# EAGLE design hivepod_interface_board_v1.1 (EAGLE 9.6.2)
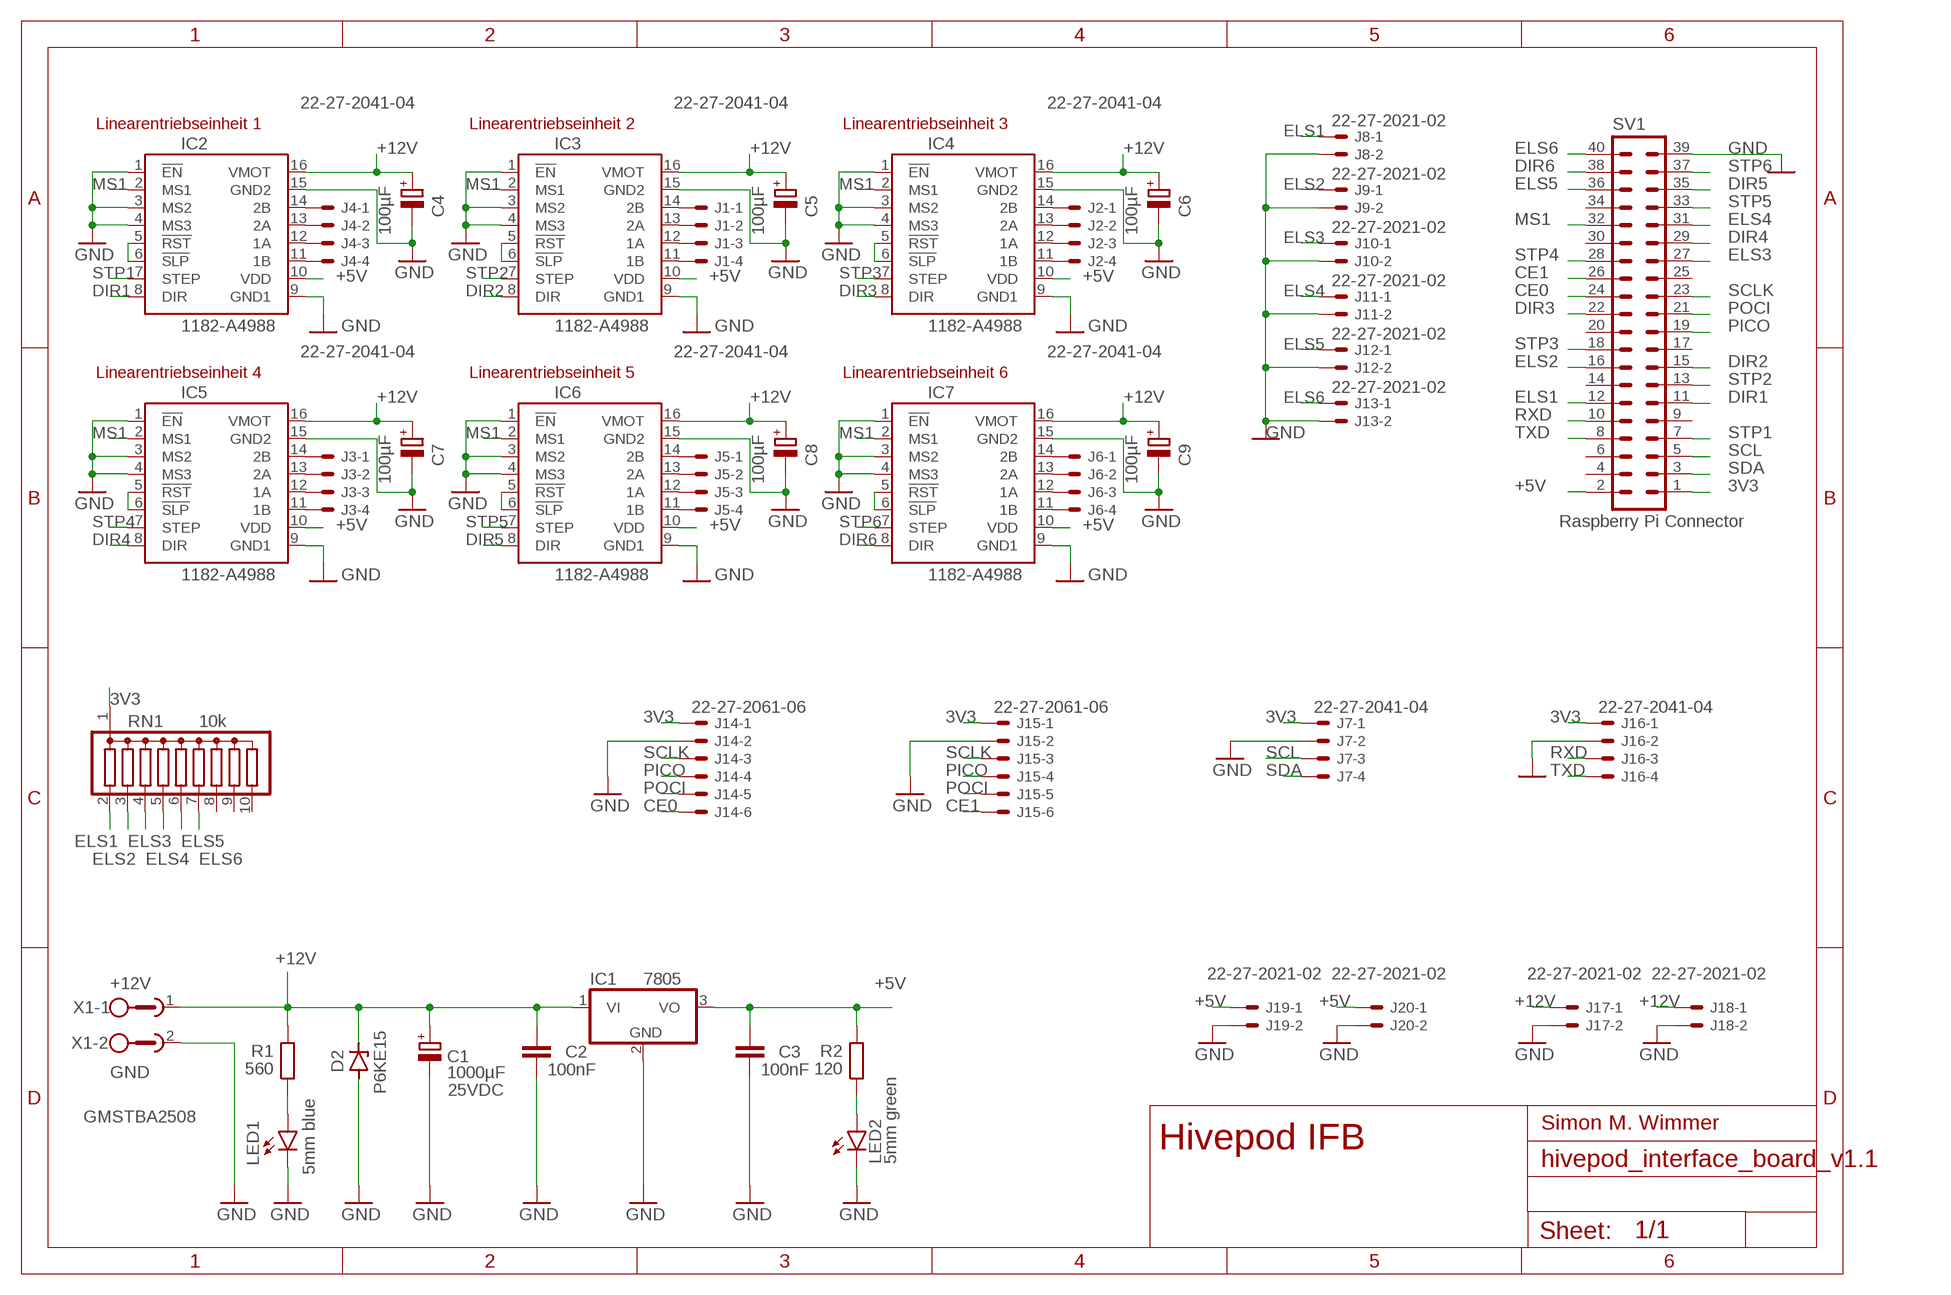
[diagram p0: schematic, sheet 1]

## Parts
C1  1000µF  CPOL-EUE5-10.5  [E5-10,5]
C2  100nF  C-EUC1206  [C1206]
C3  100nF  C-EUC1206  [C1206]
C4  100µF  CPOL-EUE5-6  [E5-6]
C5  100µF  CPOL-EUE5-6  [E5-6]
C6  100µF  CPOL-EUE5-6  [E5-6]
C7  100µF  CPOL-EUE5-6  [E5-6]
C8  100µF  CPOL-EUE5-6  [E5-6]
C9  100µF  CPOL-EUE5-6  [E5-6]
D2  P6KE15  BZY97  [F126Z12]
IC1  7805  78V  [TO220V]
IC2  1182-A4988  [A4988]
IC3  1182-A4988  [A4988]
IC4  1182-A4988  [A4988]
IC5  1182-A4988  [A4988]
IC6  1182-A4988  [A4988]
IC7  1182-A4988  [A4988]
J1  22-27-2041-04  [6410-04]
J2  22-27-2041-04  [6410-04]
J3  22-27-2041-04  [6410-04]
J4  22-27-2041-04  [6410-04]
J5  22-27-2041-04  [6410-04]
J6  22-27-2041-04  [6410-04]
J7  22-27-2041-04  [6410-04]
J8  22-27-2021-02  [6410-02]
J9  22-27-2021-02  [6410-02]
J10  22-27-2021-02  [6410-02]
J11  22-27-2021-02  [6410-02]
J12  22-27-2021-02  [6410-02]
J13  22-27-2021-02  [6410-02]
J14  22-27-2061-06  [6410-06]
J15  22-27-2061-06  [6410-06]
J16  22-27-2041-04  [6410-04]
J17  22-27-2021-02  [6410-02]
J18  22-27-2021-02  [6410-02]
J19  22-27-2021-02  [6410-02]
J20  22-27-2021-02  [6410-02]
LED1  5mm blue  LED5MM  [LED5MM]
LED2  5mm green  LED5MM  [LED5MM]
R1  560  R-EU_R1206  [R1206]
R2  120  R-EU_R1206  [R1206]
RN1  10k  G09R  [SIL10]
SV1  Raspberry Pi Connector  ML40  [ML40]
X1  GMSTBA2508  [HOR-2]

## Nets
3V3: J7.1 J14.1 J15.1 J16.1 RN1.1 SV1.1
+5V: C3.1 IC1.3(VO) IC2.10(VDD) IC3.10(VDD) IC4.10(VDD) IC5.10(VDD) IC6.10(VDD) IC7.10(VDD) J19.1 J20.1 R2.2 SV1.2
+12V: C1.+ C2.1 C4.+ C5.+ C6.+ C7.+ C8.+ C9.+ D2.C IC1.1(VI) IC2.16(VMOT) IC3.16(VMOT) IC4.16(VMOT) IC5.16(VMOT) IC6.16(VMOT) IC7.16(VMOT) J17.1 J18.1 R1.2 X1.1
CE0: J14.6 SV1.24
CE1: J15.6 SV1.26
DIR1: IC2.8(DIR) SV1.11
DIR2: IC3.8(DIR) SV1.15
DIR3: IC4.8(DIR) SV1.22
DIR4: IC5.8(DIR) SV1.29
DIR5: IC6.8(DIR) SV1.35
DIR6: IC7.8(DIR) SV1.38
ELS1: J8.1 RN1.2 SV1.12
ELS2: J9.1 RN1.3 SV1.16
ELS3: J10.1 RN1.4 SV1.27
ELS4: J11.1 RN1.5 SV1.31
ELS5: J12.1 RN1.6 SV1.36
ELS6: J13.1 RN1.7 SV1.40
GND: C1.- C2.2 C3.2 C4.- C5.- C6.- C7.- C8.- C9.- D2.A IC1.2(GND) IC2.1(!EN) IC2.3(MS2) IC2.4(MS3) IC2.9(GND1) IC2.15(GND2) IC3.1(!EN) IC3.3(MS2) IC3.4(MS3) IC3.9(GND1) IC3.15(GND2) IC4.1(!EN) IC4.3(MS2) IC4.4(MS3) IC4.9(GND1) IC4.15(GND2) IC5.1(!EN) IC5.3(MS2) IC5.4(MS3) IC5.9(GND1) IC5.15(GND2) IC6.1(!EN) IC6.3(MS2) IC6.4(MS3) IC6.9(GND1) IC6.15(GND2) IC7.1(!EN) IC7.3(MS2) IC7.4(MS3) IC7.9(GND1) IC7.15(GND2) J7.2 J8.2 J9.2 J10.2 J11.2 J12.2 J13.2 J14.2 J15.2 J16.2 J17.2 J18.2 J19.2 J20.2 LED1.K(C) LED2.K(C) SV1.39 X1.2
MS1: IC2.2(MS1) IC3.2(MS1) IC4.2(MS1) IC5.2(MS1) IC6.2(MS1) IC7.2(MS1) SV1.32
N$1: LED1.A R1.1
N$2: LED2.A R2.1
N$4: IC6.14(2B) J5.1
N$5: IC6.13(2A) J5.2
N$6: IC6.12(1A) J5.3
N$7: IC6.11(1B) J5.4
N$8: IC7.14(2B) J6.1
N$9: IC7.13(2A) J6.2
N$10: IC7.12(1A) J6.3
N$11: IC7.11(1B) J6.4
N$12: IC3.5(!RST) IC3.6(!SLP)
N$13: IC4.14(2B) J2.1
N$14: IC4.13(2A) J2.2
N$15: IC4.12(1A) J2.3
N$16: IC4.11(1B) J2.4
N$17: IC4.5(!RST) IC4.6(!SLP)
N$18: IC5.14(2B) J3.1
N$19: IC5.13(2A) J3.2
N$20: IC5.12(1A) J3.3
N$21: IC5.11(1B) J3.4
N$22: IC5.5(!RST) IC5.6(!SLP)
N$23: IC3.14(2B) J1.1
N$24: IC3.13(2A) J1.2
N$25: IC3.12(1A) J1.3
N$26: IC3.11(1B) J1.4
N$27: IC6.5(!RST) IC6.6(!SLP)
N$28: IC2.14(2B) J4.1
N$29: IC2.13(2A) J4.2
N$30: IC2.12(1A) J4.3
N$31: IC2.5(!RST) IC2.6(!SLP)
N$32: IC2.11(1B) J4.4
N$33: IC7.5(!RST) IC7.6(!SLP)
PICO: J14.4 J15.4 SV1.19
POCI: J14.5 J15.5 SV1.21
RXD: J16.3 SV1.10
SCL: J7.3 SV1.5
SCLK: J14.3 J15.3 SV1.23
SDA: J7.4 SV1.3
STP1: IC2.7(STEP) SV1.7
STP2: IC3.7(STEP) SV1.13
STP3: IC4.7(STEP) SV1.18
STP4: IC5.7(STEP) SV1.28
STP5: IC6.7(STEP) SV1.33
STP6: IC7.7(STEP) SV1.37
TXD: J16.4 SV1.8
Unconnected: RN1.8 RN1.9 RN1.10 SV1.4 SV1.6 SV1.9 SV1.14 SV1.17 SV1.20 SV1.25 SV1.30 SV1.34

## Notes on the sheet
- Linearentriebseinheit 1 | Linearentriebseinheit 2 | Linearentriebseinheit 3
- Linearentriebseinheit 4 | Linearentriebseinheit 5 | Linearentriebseinheit 6
- +12V
- GND
- 25VDC
- Simon M. Wimmer
- Hivepod IFB

## Library data of the parts
C1 = rcl:CPOL-EU: POLARIZED CAPACITOR, European symbol; SPICEPREFIX: C
C2 C3 = rcl:C-EU: CAPACITOR, European symbol; SPICEPREFIX: C
C4-C9 = rcl:CPOL-EU: POLARIZED CAPACITOR, European symbol
D2 = diode:BZY97: Z DIODE
IC1 = linear:78*: Positive VOLTAGE REGULATOR Source: http://cache.national.com/ds/LM/LM78L05.pdf http://www.fairchildsemi.com/ds/LM/LM7805.pdf
IC2-IC7 = pololu-stepper-driver:1182-A4988: A4988 Stepper Motor Driver Carrier #1182 A4988 Stepper Motor Driver Carrier <https://www.pololu.com/product/1182> in Japan, Suzaku Lab. Ltd. <https://suzakugiken.jp/> #1182 A4988ステッピングモータドライバ <https://szc.jp/po1182>
J1-J7 J16 = con-molex:22-?-04: CONNECTOR wire to board 2.54 mm (.1 inch) pitch header; MF: MOLEX; OC_FARNELL: unknown; OC_NEWARK: unknown
J8-J13 J17-J20 = con-molex:22-?-02: CONNECTOR wire to board 2.54 mm (.1 inch) pitch header; MF: MOLEX; OC_FARNELL: unknown; OC_NEWARK: unknown
J14 J15 = con-molex:22-?-06: CONNECTOR wire to board 2.54 mm (.1 inch) pitch header; OC_FARNELL: unknown; OC_NEWARK: unknown
LED1 LED2 = led:LED: LED OSRAM: - CHIPLED LG R971, LG N971, LY N971, LG Q971, LY Q971, LO R971, LY R971 LH N974, LH R974 LS Q976, LO Q976, LY Q976 LO Q996 - Hyper CHIPLED LW Q18S LB Q993, LB Q99A, LB R99A - SideLED LS A670, LO A670, LY A670, LG A670, LP A670 LB A673, LV A673, LT A673, LW A673 LH A674 LY A675 LS A676, LA A676, LO A676, LY A676, LW A676 LS A679, LY A679, LG A679 - Hyper Micro SIDELED® LS Y876, LA Y876, LO Y876, LY Y876 LT Y87S - SmartLED LW L88C, LW L88S LB L89C, LB L89S, LG L890 LS L89K, LO L89K, LY L89K LS L896, LA L896, LO L896, LY L896 - TOPLED LS T670, LO T670, LY T670, LG T670, LP T670 LSG T670, LSP T670, LSY T670, LOP T670, LYG T670 LG T671, LOG T671, LSG T671 LB T673, LV T673, LT T673, LW T673 LH T674 LS T676, LA T676, LO T676, LY T676, LB T676, LH T676, LSB T676, LW T676 LB T67C, LV T67C, LT T67C, LS T67K, LO T67K, LY T67K, LW E67C LS E67B, LA E67B, LO E67B, LY E67B, LB E67C, LV E67C, LT E67C LW T67C LS T679, LY T679, LG T679 LS T770, LO T770, LY T770, LG T770, LP T770 LB T773, LV T773, LT T773, LW T773 LH T774 LS E675, LA E675, LY E675, LS T675 LS T776, LA T776, LO T776, LY T776, LB T776 LHGB T686 LT T68C, LB T68C - Hyper Mini TOPLED® LB M676 - Mini TOPLED Santana® LG M470 LS M47K, LO M47K, LY M47K Source: http://www.osram.convergy.de LUXEON: - LUMILED® LXK2-PW12-R00, LXK2-PW12-S00, LXK2-PW14-U00, LXK2-PW14-V00 LXK2-PM12-R00, LXK2-PM12-S00, LXK2-PM14-U00 LXK2-PE12-Q00, LXK2-PE12-R00, LXK2-PE12-S00, LXK2-PE14-T00, LXK2-PE14-U00 LXK2-PB12-K00, LXK2-PB12-L00, LXK2-PB12-M00, LXK2-PB14-N00, LXK2-PB14-P00, LXK2-PB14-Q00 LXK2-PR12-L00, LXK2-PR12-M00, LXK2-PR14-Q00, LXK2-PR14-R00 LXK2-PD12-Q00, LXK2-PD12-R00, LXK2-PD12-S00 LXK2-PH12-R00, LXK2-PH12-S00 LXK2-PL12-P00, LXK2-PL12-Q00, LXK2-PL12-R00 Source: www.luxeon.com KINGBRIGHT: KA-3528ASYC Source: www.kingbright.com
R1 R2 = rcl:R-EU_: RESISTOR, European symbol
RN1 = resistor-sil:G09R: SIL RESISTOR; OC_FARNELL: unknown; OC_NEWARK: unknown
SV1 = con-ml:ML40: HARTING; OC_FARNELL: unknown; OC_NEWARK: unknown
X1 = con-phoenix-508:GMSTBA2: PHOENIX

## Board
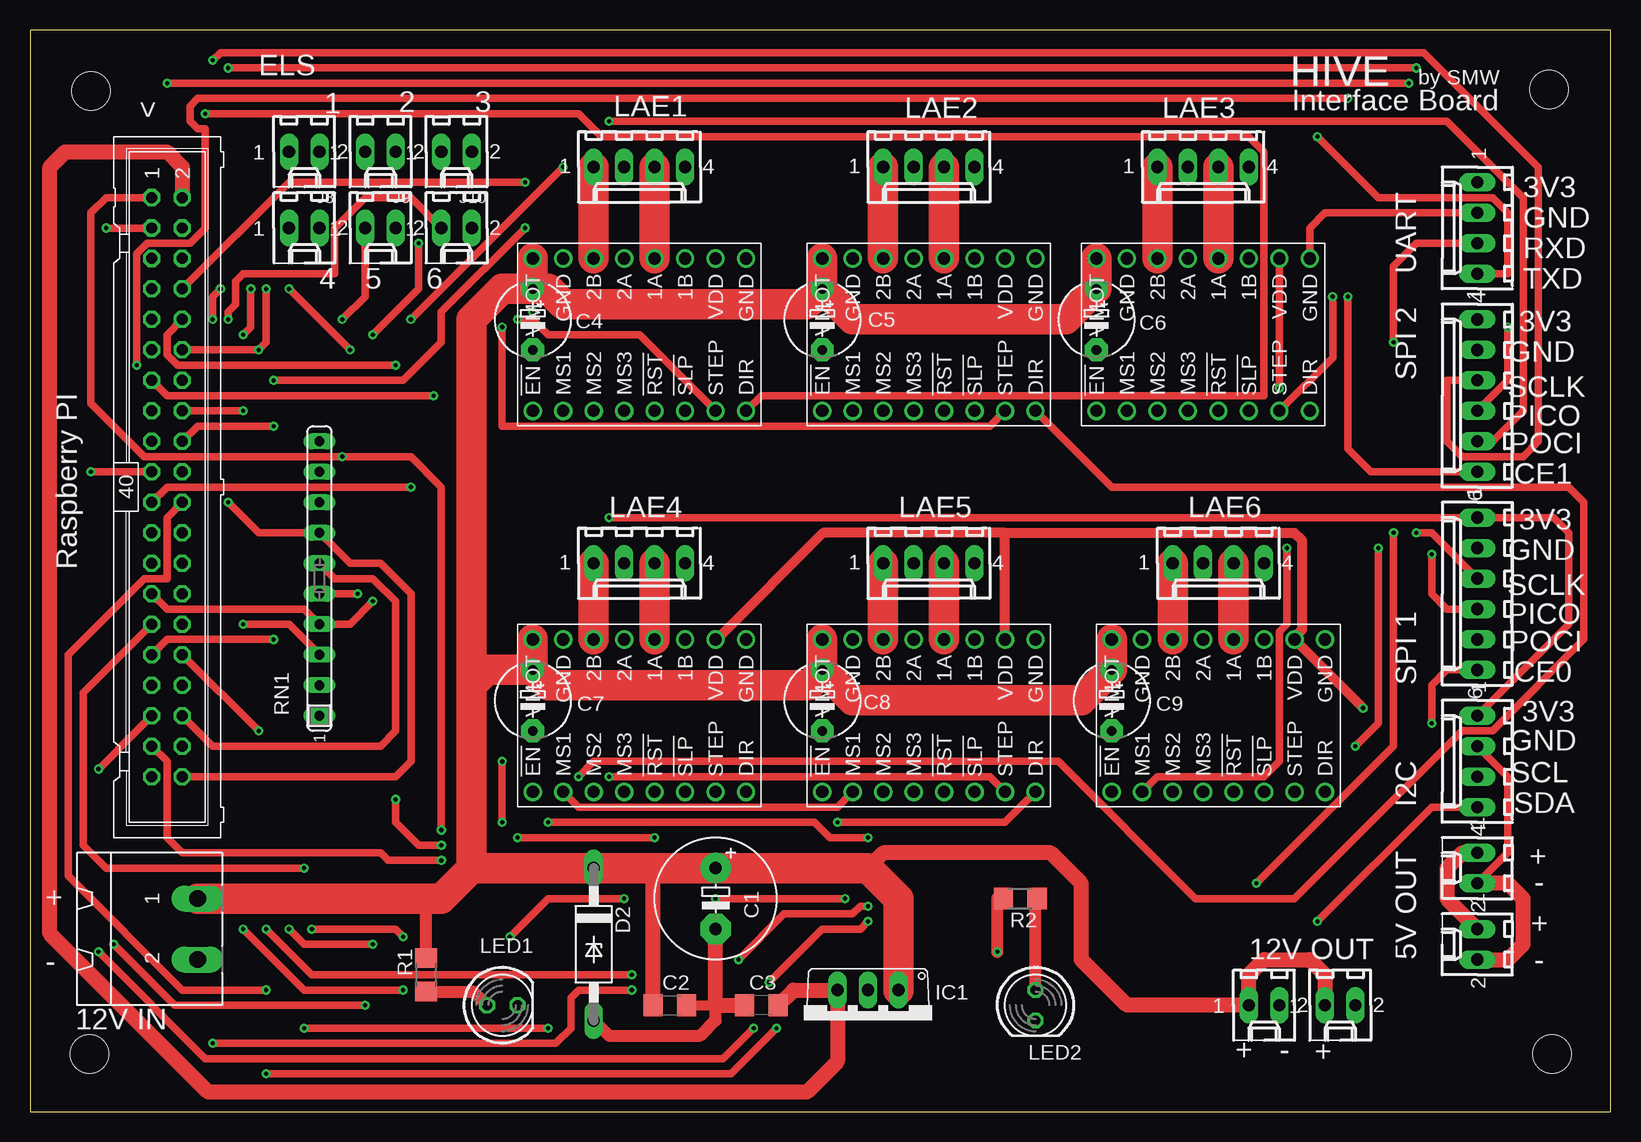
[diagram p1: board, top side]
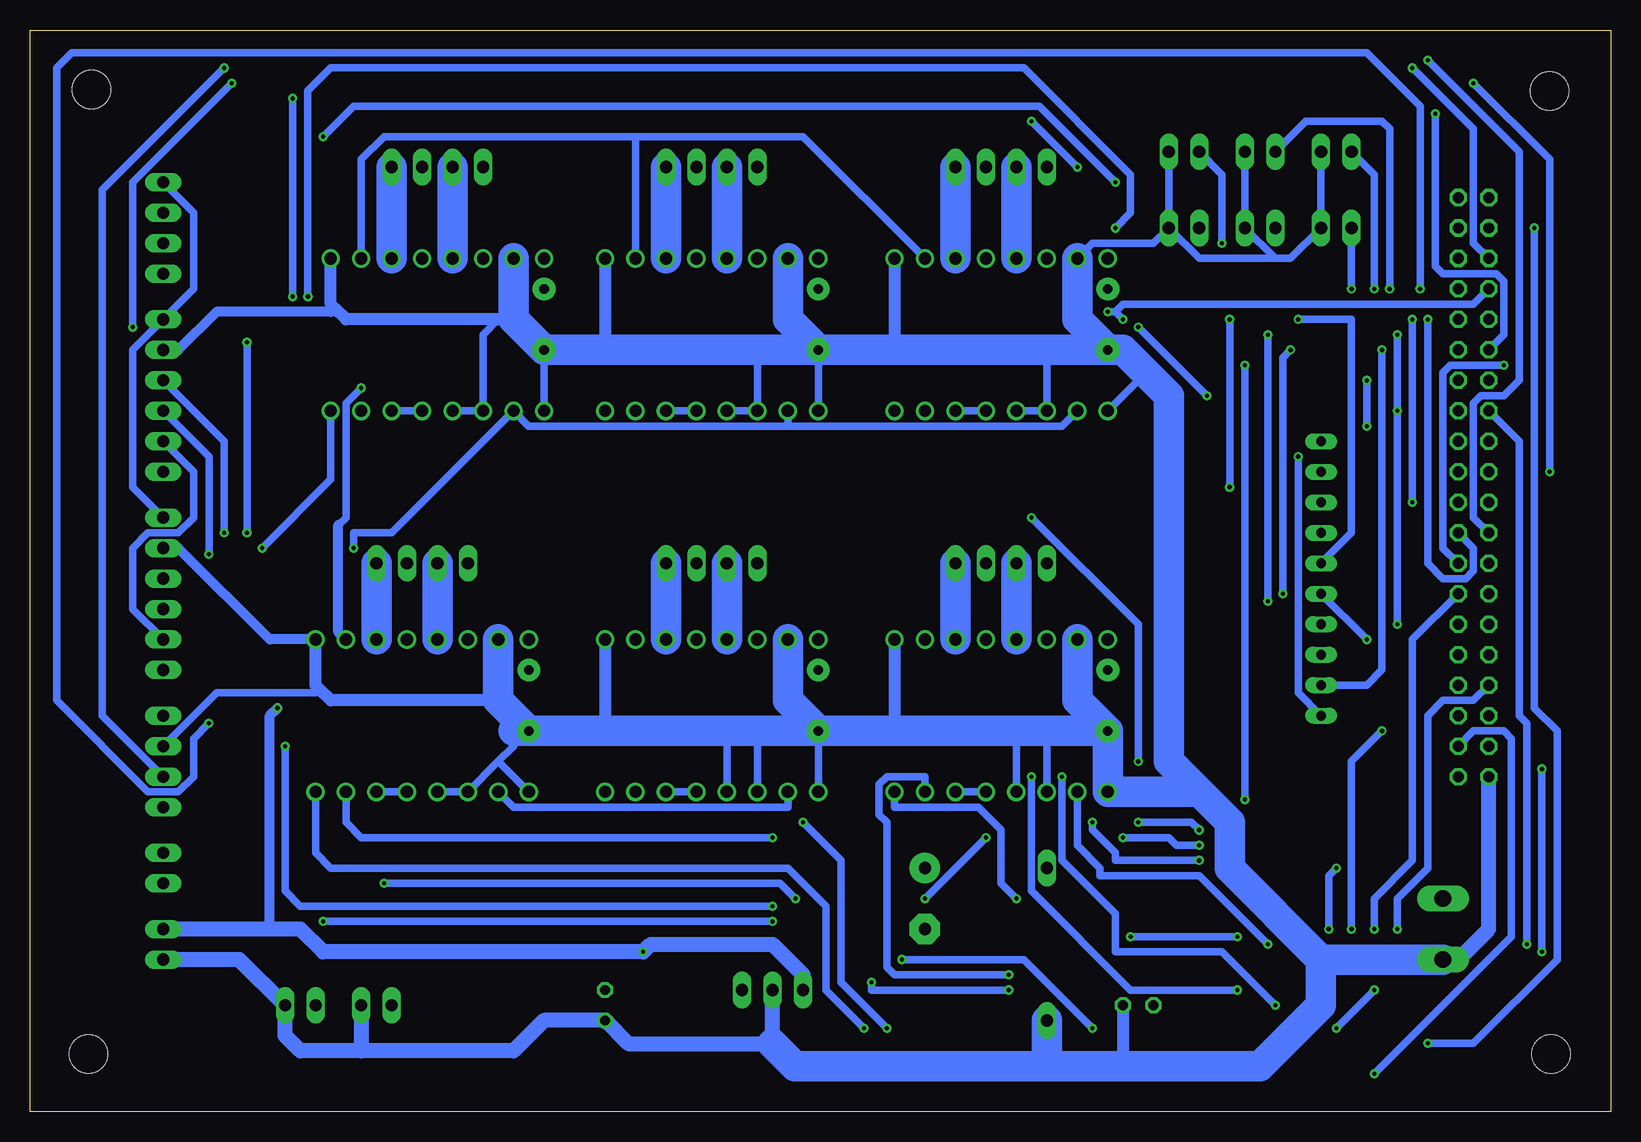
[diagram p2: board, bottom side, seen from below]

Size 131.75 x 90.16 mm. Coordinates in mm from the lower left corner, seen from the top.
Outline: 0,0 131.75,0 131.75,90.16 0,90.16 0,0
Copper layers (1*16): Top 0.035mm / dielectric 1.5mm / Bottom 0.035mm
Design rules "default *": minimum track width 24mil, minimum drill 0.35mm, track to track 20mil, track to pad 6mil, pad to pad 6mil, via to via 6mil, smd to smd 6mil, copper to edge 40mil, drill to drill 6mil, minimum pad ring 10mil, minimum via ring 8mil, stop-mask expansion 4mil, vias tented up to drill 0mil, thermal gap 10mil
Holes 3.2 mm at 4.95,4.83 126.87,4.83 126.62,85.22 5.08,85.09

### Footprints (pad centres in the part's own frame; a part is rotated, then mirrored left to right if it is on the bottom)
E5-10,5 = drill 1.016 pad 2.54: + -2.54,0 | drill 1.016 pad 2.54 octagon: - 2.54,0
C1206 = smd 1.6 x 1.8: 1 -1.4,0; 2 1.4,0
E5-6 = drill 0.813 pad 1.905: + -2.54,0 | drill 0.813 pad 1.905 octagon: - 2.54,0
F126Z12 = drill 1.016 long: A 6.35,0; C -6.35,0
TO220V = drill 1.016 long: 1 -2.54,-2.54; 2 0,-2.54; 3 2.54,-2.54
A4988 = drill 1.016: 1 -6.35,8.89; 2 -6.35,6.35; 3 -6.35,3.81; 4 -6.35,1.27; 5 -6.35,-1.27; 6 -6.35,-3.81; 7 -6.35,-6.35; 8 -6.35,-8.89; 9 6.35,-8.89; 10 6.35,-6.35; 11 6.35,-3.81; 12 6.35,-1.27; 13 6.35,1.27; 14 6.35,3.81; 15 6.35,6.35; 16 6.35,8.89
6410-04 = drill 1.016 long: 1 3.81,0; 2 1.27,0; 3 -1.27,0; 4 -3.81,0
6410-02 = drill 1.016 long: 1 1.27,0; 2 -1.27,0
6410-06 = drill 1.016 long: 1 6.35,0; 2 3.81,0; 3 1.27,0; 4 -1.27,0; 5 -3.81,0; 6 -6.35,0
LED5MM = drill 0.813 octagon: A -1.27,0; K 1.27,0
R1206 = smd 1.6 x 1.8: 1 -1.4,0; 2 1.4,0
SIL10 = drill 0.813 long: 1 -11.43,0; 2 -8.89,0; 3 -6.35,0; 4 -3.81,0; 5 -1.27,0; 6 1.27,0; 7 3.81,0; 8 6.35,0; 9 8.89,0; 10 11.43,0
ML40 = drill 0.914 octagon: 1 -24.13,-1.27; 2 -24.13,1.27; 3 -21.59,-1.27; 4 -21.59,1.27; 5 -19.05,-1.27; 6 -19.05,1.27; 7 -16.51,-1.27; 8 -16.51,1.27; 9 -13.97,-1.27; 10 -13.97,1.27; 11 -11.43,-1.27; 12 -11.43,1.27; 13 -8.89,-1.27; 14 -8.89,1.27; 15 -6.35,-1.27; 16 -6.35,1.27; 17 -3.81,-1.27; 18 -3.81,1.27; 19 -1.27,-1.27; 20 -1.27,1.27; 21 1.27,-1.27; 22 1.27,1.27; 23 3.81,-1.27; 24 3.81,1.27; 25 6.35,-1.27; 26 6.35,1.27; 27 8.89,-1.27; 28 8.89,1.27; 29 11.43,-1.27; 30 11.43,1.27; 31 13.97,-1.27; 32 13.97,1.27; 33 16.51,-1.27; 34 16.51,1.27; 35 19.05,-1.27; 36 19.05,1.27; 37 21.59,-1.27; 38 21.59,1.27; 39 24.13,-1.27; 40 24.13,1.27
HOR-2 = drill 1.397 pad 2.184 long: 1 -2.54,10.16; 2 2.54,10.16

### Placement (x,y rotation side)
C1  57.15,17.78 270 top
C2  53.34,8.89 0 top
C3  60.96,8.89 180 top
C4  41.91,66.04 270 top
C5  66.04,66.04 270 top
C6  88.9,66.04 270 top
C7  41.91,34.29 270 top
C8  66.04,34.29 270 top
C9  90.17,34.29 270 top
D2  46.99,13.97 270 top
IC1  69.85,7.62 180 top
IC2  50.8,64.77 90 top
IC3  74.93,64.77 90 top
IC4  97.79,64.77 90 top
IC5  50.8,33.02 90 top
IC6  74.93,33.02 90 top
IC7  99.06,33.02 90 top
J1  74.93,78.74 180 top
J2  97.79,78.74 180 top
J3  50.8,45.72 180 top
J4  50.8,78.74 180 top
J5  74.93,45.72 180 top
J6  99.06,45.72 180 top
J7  120.65,29.21 90 top
J8  22.86,80.01 180 top
J9  29.21,80.01 180 top
J10  35.56,80.01 180 top
J11  22.86,73.66 180 top
J12  29.21,73.66 180 top
J13  35.56,73.66 180 top
J14  120.65,43.18 90 top
J15  120.65,59.69 90 top
J16  120.65,73.66 90 top
J17  102.87,8.89 180 top
J18  109.22,8.89 180 top
J19  120.65,13.97 90 top
J20  120.65,20.32 90 top
LED1  39.37,8.89 0 top
LED2  83.82,8.89 270 top
R1  33.02,11.43 90 top
R2  82.55,17.78 180 top
RN1  24.13,44.45 90 top
SV1  11.43,52.07 270 top
X1  3.81,15.24 270 top

### Tracks (layer width: path | path; a pad name or v marks a point on that pad's centre or on a via)
3V3  (via drill 0.35)
  Top 0.61: J7.1 128.27,40.64 128.27,48.26 127,49.53 J14.1 v48.26,49.53 | SV1.1 6.35,76.2 5.08,74.93 5.08,59.05 9.53,54.61 v26.04,54.61 31.75,54.61 34.29,52.07 v34.29,23.5 | v39.37,24.13 v39.37,29.21
  Bottom 0.61: J16.1 118.11,74.93 118.11,68.58 J15.1 123.19,63.5 123.19,52.07 J14.1 | RN1.1 26.04,34.92 v26.04,54.61 | v48.26,49.53 39.37,40.64 v39.37,29.21 | v39.37,24.13 34.92,24.13 v34.29,23.5
+5V  (via drill 0.35)
  Top 0.61: 80.64,17.78 R2.2 | v104.14,60.33 IC4.10 | 81.28,48.21 81.28,48.26
  Top 0.813: IC5.10 57.43,39.57 66.12,48.26 81.28,48.26 105.41,48.26 106.05,47.62 106.05,40.19 105.41,39.55 IC7.10 v111.12,33.66 | IC6.10 81.28,48.21
  Top 1.016: v80.64,13.34 80.64,17.78
  Top 1.27: C3.1 63.63,10.16 IC1.3 67.31,4.19 64.77,1.65 14.86,1.65 1.65,14.86 1.65,78.74 2.92,80.01 11.43,80.01 12.7,78.74 SV1.2 | J19.1 118.11,17.78 118.11,20.32 119.38,21.59 J20.1
  Bottom 0.61: IC2.10 67.31,81.28 81.28,81.28 | IC3.10 81.28,81.28 | IC4.10 104.14,79.38 102.23,81.28 81.28,81.28 | v104.14,60.33 105.41,59.05 105.41,49.53 106.05,48.9
  Bottom 0.813: v111.12,33.66 111.76,33.02 111.76,15.24 | 106.05,48.9 106.05,40.01 IC7.10
  Bottom 1.27: IC1.3 67.31,11.43 69.85,13.97 80.01,13.97 v80.64,13.34 107.31,13.34 109.22,15.24 111.76,15.24 J19.1
+12V
  Top 0.61: C8.+ 66.04,36.68
  Top 1.016: R1.2 33.02,17.78
  Top 1.27: J18.1 107.95,11.43 106.68,12.7 102.87,12.7 101.6,11.43 J17.1 91.44,8.89 87.63,12.7 87.63,19.05 85.09,21.59 71.12,21.59 69.85,20.32 | C2.1 51.94,20.19 52.07,20.32
  Top 2.54: C7.+ IC5.16 | IC6.16 C8.+ 68.58,34.29 87.63,34.29 C9.+ IC7.16 | IC4.16 C6.+ 86.36,66.04 68.58,66.04 C5.+ | C5.+ IC3.16 | C4.+ IC2.16 | 36.83,35.56 36.83,20.32 | 36.83,35.56 38.1,36.83 C7.+ | 36.83,35.56 36.83,66.04 39.37,68.58 C4.+ | IC1.1 72.39,17.78 69.85,20.32 C1.+ 52.07,20.32 D2.C 36.83,20.32 | 36.83,20.32 34.29,17.78 33.02,17.78 X1.1 | C7.+ 43.18,35.56 64.92,35.56 66.04,36.68 | C4.+ 43.18,68.58 44.45,67.31 64.77,67.31 C5.+
CE0  (via drill 0.35)
  Top 0.61: v15.24,66.04 15.24,67.94 v15.88,68.58 | v116.84,32.38 116.84,35.56 118.11,36.83 J14.6
  Bottom 0.61: SV1.24 11.43,46.99 11.43,45.09 12.06,44.45 13.97,44.45 15.24,45.72 v15.24,66.04 | v15.88,68.58 15.88,83.82 20.32,88.27 128.27,88.27 129.54,87 129.54,34.29 121.92,26.67 119.38,26.67 118.11,27.94 118.11,31.11 v116.84,32.38
CE1  (via drill 0.35)
  Top 0.61: v109.86,84.45 13.97,84.45 13.34,83.82 13.34,82.55 13.97,81.92 14.61,81.92 14.61,73.66 13.34,72.39 9.78,72.39 8.89,71.5 v8.89,62.23 | J15.6 111.76,53.34 109.86,55.24 v109.86,67.94
  Bottom 0.61: SV1.26 13.97,46.99 13.97,61.59 13.34,62.23 v8.89,62.23 | v109.86,67.94 v109.86,84.45
DIR1  (via drill 0.35)
  Top 0.61: v14.61,83.19 45.72,83.19 47.62,81.28 101.6,81.28 102.87,80.01 102.87,59.69 60.96,59.69 IC2.8
  Bottom 0.61: SV1.11 8.89,64.77 8.89,69.22 9.53,69.85 13.97,69.85 14.61,70.48 v14.61,83.19
DIR2  (via drill 0.35)
  Top 0.61: v6.99,13.97 12.06,8.89 v27.94,8.89 | v45.72,27.94 46.99,29.21 85.72,29.21 97.16,17.78 105.41,17.78 119.38,31.75 121.92,31.75 129.54,39.37 129.54,50.8 128.27,52.07 90.17,52.07 IC3.8
  Bottom 0.61: SV1.15 7.62,55.88 7.62,33.02 6.99,32.38 v6.99,13.97 | v27.94,8.89 32.38,13.34 41.27,13.34 41.27,16.51 45.72,20.95 v45.72,27.94
DIR3  (via drill 0.35)
  Top 0.61: SV1.22 11.43,49.53 11.43,44.45 9.53,44.45 3.17,38.1 3.17,19.68 12.7,10.16 v19.68,10.16 | v43.18,6.99 v22.86,6.99 | v59.05,12.7 62.87,16.51 68.58,16.51 69.22,17.14 v69.85,17.14 | v110.49,30.48 112.39,32.38 v112.39,46.99
  Bottom 0.61: v22.86,6.99 v19.68,10.16 | v43.18,6.99 48.9,12.7 v59.05,12.7 | v69.85,17.14 109.22,17.14 110.49,18.41 v110.49,30.48 | v112.39,46.99 106.68,52.7 IC4.8
DIR4  (via drill 0.35)
  Top 0.61: SV1.29 4.45,34.92 4.45,22.23 6.35,20.32 v22.86,20.32 | v23.5,15.24 30.48,15.24 v31.11,14.61 | v40.01,14.61 43.18,17.78 v49.53,17.78
  Bottom 0.61: v22.86,20.32 23.5,19.68 v23.5,15.24 | v40.01,14.61 v31.11,14.61 | v49.53,17.78 50.8,19.05 50.8,23.5 52.7,25.4 59.69,25.4 IC5.8
DIR5  (via drill 0.35)
  Top 0.61: v5.71,28.57 8.89,31.75 SV1.35 | v5.71,13.34 14.61,4.45 57.78,4.45 v60.33,6.99 | v67.31,24.13 81.28,24.13 IC6.8
  Bottom 0.61: v5.71,13.34 v5.71,28.57 | v60.33,6.99 64.14,10.79 64.14,20.95 v67.31,24.13
DIR6  (via drill 0.35)
  Top 0.61: v19.68,3.17 58.42,3.17 v62.23,6.99
  Bottom 0.61: SV1.38 11.43,31.75 8.89,31.75 8.26,31.11 8.26,14.61 v19.68,3.17 | v62.23,6.99 65.41,10.16 65.41,17.14 68.58,20.32 106.68,20.32 107.95,21.59 IC7.8
ELS1  (via drill 0.35)
  Top 0.61: SV1.12 v19.05,63.5 19.68,64.14 v19.68,68.58
  Bottom 0.61: RN1.2 20.32,35.56 19.05,36.83 v19.05,63.5 | J8.1 19.68,78.11 v19.68,68.58
ELS2  (via drill 0.35)
  Top 0.61: RN1.3 21.59,40.64 v17.78,40.64 | SV1.16 v17.78,58.42 | v17.78,64.77 18.41,65.41 v18.41,68.58
  Bottom 0.61: v17.78,40.64 v17.78,58.42 v17.78,64.77 | J9.1 25.4,82.55 19.05,82.55 18.41,81.92 v18.41,68.58
ELS3  (via drill 0.35)
  Top 0.61: SV1.27 11.43,41.91 22.86,41.91 RN1.4 26.67,40.64 v28.57,42.55 | v32.38,72.39 32.38,68.58 v28.57,64.77
  Bottom 0.61: J10.1 32.38,78.11 v32.38,72.39 | v28.57,42.55 v28.57,64.77
ELS4  (via drill 0.35)
  Top 0.61: v20.32,39.37 11.43,39.37 SV1.31 | v26.67,63.5 v21.59,68.58 | RN1.5 v27.3,43.18
  Bottom 0.61: v20.32,39.37 RN1.5 | v21.59,68.58 J11.1 | v26.67,63.5 27.3,62.87 v27.3,43.18
ELS5  (via drill 0.35)
  Top 0.61: RN1.6 25.4,44.45 28.57,44.45 30.48,42.55 30.48,31.75 29.21,30.48 15.24,30.48 SV1.36 | v26.04,66.04 27.94,67.94 J12.1
  Bottom 0.61: v26.04,66.04 21.59,66.04 21.59,48.26 RN1.6
ELS6  (via drill 0.35)
  Top 0.61: SV1.40 30.48,27.94 31.75,29.21 31.75,43.18 29.21,45.72 26.67,45.72 RN1.7 19.05,48.26 v16.51,50.8 | J13.1 31.75,76.2 27.94,76.2 25.4,73.66 25.4,69.85 17.78,69.85 17.14,69.22 17.14,67.31 16.51,66.67 v16.51,66.04
  Bottom 0.61: v16.51,50.8 v16.51,66.04
GND
  Top 0.61: J16.2 107.95,74.93 106.68,73.66 IC4.9 | J20.2 123.19,21.59 123.19,27.94 J7.2
  Top 0.813: C2.2 57.15,8.89
  Top 1.016: D2.A 48.26,6.35 55.88,6.35 57.15,7.62 57.15,8.89
  Top 1.27: C3.2 57.15,8.89 C1.- | J19.2 123.19,12.7 124.46,13.97 124.46,17.78 123.19,19.05 J20.2
  Bottom 0.61: IC5.3 46.99,31.75 | IC5.4 49.53,31.75 | IC6.3 71.12,31.75 | IC6.4 73.66,31.75 | 92.71,29.21 IC7.3 IC7.4 | 92.71,29.21 91.44,30.48 91.44,31.75 | 46.99,63.5 IC2.3 IC2.4 | 71.12,63.5 IC3.3 IC3.4 | 91.44,66.04 92.71,66.04 93.98,64.77 IC4.3 IC4.4 | 27.94,71.12 J12.2 J9.2 | J13.2 34.29,71.12 27.94,71.12 | J7.2 116.2,34.92 107.95,34.92 107.63,35.24 | C8.- IC6.1 | 38.73,61.59 IC2.1 | C5.- IC3.1 | C6.- IC4.1 | 92.71,29.21 IC7.1 | 106.68,66.67 106.36,66.99 | J13.2 38.1,72.39 43.18,72.39 IC2.15 | 27.94,71.12 26.67,71.12 J11.2 J8.2 | J13.2 J10.2
  Bottom 0.813: J14.2 119.38,46.99 111.76,39.37 IC7.9 | J15.2 119.38,63.5 116.2,66.67 106.68,66.67
  Bottom 1.016: IC3.9 83.82,63.5 | 92.71,66.04 105.41,66.04 106.36,66.99 106.68,67.31 IC4.9 | IC2.9 59.69,63.5 | IC5.9 59.69,31.75 | IC6.9 83.82,31.75 | 92.71,34.29 106.68,34.29 107.63,35.24 107.95,35.56 IC7.9 | LED1.K 40.64,3.81
  Bottom 1.27: IC1.2 69.88,10.13 69.88,5.7 69.87,5.69 81.89,5.69 LED2.K 88.9,7.62 91.44,5.08 104.14,5.08 | 104.14,5.08 109.22,5.08 110.49,6.35 J18.2 114.3,12.7 J19.2 | J17.2 104.14,5.08 | X1.2 12.7,12.7 10.16,15.24 SV1.39
  Bottom 2.54: IC2.15 44.45,66.04 C4.- | IC3.15 68.58,66.04 C5.- | IC4.15 91.44,66.04 C6.- 83.82,63.5 71.12,63.5 C5.- | IC7.15 92.71,34.29 C9.- | IC6.15 68.58,34.29 C8.- | IC5.15 44.45,34.29 C7.- | X1.2 24.13,12.7 | 24.13,12.7 31.75,20.32 31.75,24.13 34.29,26.67 | 34.29,26.67 IC5.1 C7.- | C7.- 46.99,31.75 49.53,31.75 59.69,31.75 C8.- | 91.44,31.75 C9.- | C9.- 83.82,31.75 73.66,31.75 71.12,31.75 C8.- | 34.29,26.67 36.83,29.21 36.83,59.69 38.73,61.59 40.64,63.5 C4.- | C4.- 46.99,63.5 59.69,63.5 C5.- | 69.87,5.69 67.99,3.81 46.99,3.81 | 24.13,12.7 24.13,8.89 29.21,3.81 40.64,3.81 46.99,3.81 | D2.A 46.99,3.81
MS1  (via drill 0.35)
  Top 0.61: v19.05,31.75 SV1.32 | v21.59,15.24 22.86,13.97 v28.57,13.97 | IC6.2 67.31,25.4 45.72,25.4 IC5.2 | v104.78,46.99 104.78,40.64 104.14,40.01 104.14,29.21 102.87,27.94 93.98,27.94 IC7.2
  Bottom 0.61: IC2.2 45.72,57.15 68.58,57.15 | IC3.2 68.58,57.15 | 68.58,57.15 90.17,57.15 IC4.2 101.6,48.26 104.78,48.26 v104.78,46.99 | v19.05,31.75 21.59,29.21 v21.59,15.24 | v28.57,13.97 34.29,19.68 42.55,19.68 42.55,20.32 44.45,22.23 IC5.2 | IC7.2 91.44,25.4 68.58,25.4 IC6.2
N$1
  Top 1.016: R1.1 36.96,10.03 LED1.A
N$2
  Top 0.61: 83.82,17.78 R2.1
  Top 1.016: LED2.A 83.82,17.78
N$4
  Top 2.54: IC6.14 J5.1
N$5
  Bottom 2.54: IC6.13 J5.2
N$6
  Top 2.54: IC6.12 J5.3
N$7
  Bottom 2.54: IC6.11 J5.4
N$8
  Top 2.54: IC7.14 J6.1
N$9
  Bottom 2.54: IC7.13 J6.2
N$10
  Top 2.54: IC7.12 J6.3
N$11
  Bottom 2.54: IC7.11 J6.4
N$12
  Bottom 0.61: IC3.5 IC3.6
N$13
  Top 2.54: IC4.14 J2.1
N$14
  Bottom 2.54: J2.2 IC4.13
N$15
  Top 2.54: IC4.12 J2.3
N$16
  Bottom 2.54: IC4.11 J2.4
N$17
  Bottom 0.61: IC4.5 IC4.6
N$18
  Top 2.54: IC5.14 J3.1
N$19
  Bottom 2.54: IC5.13 J3.2
N$20
  Top 2.54: IC5.12 J3.3
N$21
  Bottom 2.54: IC5.11 J3.4
N$22
  Bottom 0.61: IC5.5 IC5.6
N$23
  Top 2.54: IC3.14 J1.1
N$24
  Bottom 2.54: IC3.13 J1.2
N$25
  Top 2.54: IC3.12 J1.3
N$26
  Bottom 2.54: IC3.11 J1.4
N$27
  Bottom 0.61: IC6.5 IC6.6
N$28
  Top 2.54: IC2.14 J4.1
N$29
  Bottom 2.54: IC2.13 J4.2
N$30
  Top 2.54: IC2.12 J4.3
N$31
  Bottom 0.61: IC2.5 IC2.6
N$32
  Bottom 2.54: IC2.11 J4.4
N$33
  Bottom 0.61: IC7.5 IC7.6
PICO  (via drill 0.35)
  Top 0.61: v5.08,53.34 SV1.19 | v114.94,85.72 v11.43,85.72 | v123.19,65.41 123.19,60.96 J15.4 | J14.4 118.11,41.91 116.84,43.18 v116.84,46.48
  Bottom 0.61: v5.08,53.34 5.08,79.38 v11.43,85.72 | v114.94,85.72 123.19,77.47 v123.19,65.41 | J15.4 116.81,54.58 116.81,46.51 v116.84,46.48
POCI  (via drill 0.35)
  Top 0.61: SV1.21 11.43,52.07 v31.75,52.07 | v44.45,78.74 v31.75,66.04 | v48.26,82.55 118.11,82.55 124.46,76.2 124.46,58.42 121.92,55.88 J15.5
  Bottom 0.61: v31.75,66.04 v31.75,52.07 | v48.26,82.55 v44.45,78.74 | J14.5 123.19,41.91 123.19,46.99 121.92,48.26 119.38,48.26 118.11,49.53 118.11,53.34 J15.5
RXD  (via drill 0.35)
  Top 0.61: SV1.10 11.43,64.77 11.43,63.12 12.32,62.23 v30.48,62.23 | v30.48,26.04 30.48,24.13 32.38,22.23 v34.29,22.23 | v52.07,22.86 v40.64,22.86 | v67.94,17.78 v57.15,17.78 | v102.23,19.05 113.67,30.48 v113.67,48.26 | v113.67,64.14 113.67,70.48 115.57,72.39 J16.3
  Bottom 0.61: v30.48,26.04 v30.48,62.23 | v34.29,22.23 36.2,22.23 36.83,22.86 v40.64,22.86 | v57.15,17.78 v52.07,22.86 | v67.94,17.78 69.22,19.05 v102.23,19.05 | v113.67,48.26 v113.67,64.14
SCL  (via drill 0.35)
  Top 0.61: v115.57,87 v16.51,87
  Bottom 0.61: SV1.5 11.43,72.39 11.43,81.92 14.29,84.77 v16.51,87 | v115.57,87 125.73,76.83 125.73,33.02 J7.3
SCLK  (via drill 0.35)
  Top 0.61: v15.24,87.63 15.88,88.27 116.2,88.27 125.73,78.74 125.73,55.88 124.46,54.61 119.38,54.61 118.11,55.88 118.11,60.96 J15.3 | J14.3 116.84,48.26 v115.57,48.26
  Bottom 0.61: SV1.23 11.43,49.53 11.43,59.05 10.79,59.69 8.89,59.69 7.62,60.96 7.62,80.01 v15.24,87.63 | v115.57,48.26 115.57,55.88 J15.3
SDA  (via drill 0.35)
  Top 0.61: v6.35,73.66 SV1.3 | v15.24,5.71 43.81,5.71 45.09,6.99 45.09,9.53 45.72,10.16 v50.16,10.16 | v61.59,10.79 66.04,15.24 69.22,15.24 v69.85,15.88 | v107.31,15.88 116.84,25.4 J7.4
  Bottom 0.61: v6.35,73.66 6.35,33.66 4.45,31.75 4.45,12.7 11.43,5.71 v15.24,5.71 | v50.16,10.16 61.59,10.16 v61.59,10.79 | v107.31,15.88 v69.85,15.88
STP1  (via drill 0.35)
  Top 0.61: IC2.7 50.8,64.77 43.18,64.77 41.91,66.04 v40.64,66.04
  Bottom 0.61: SV1.7 11.43,67.31 40.64,67.31 41.27,66.67 | v41.91,66.67 41.27,66.67 | 41.27,66.67 v40.64,66.04
STP2  (via drill 0.35)
  Top 0.61: SV1.13 11.43,59.69 v33.66,59.69 | v39.37,65.41 39.37,57.15 80.01,57.15 IC3.7
  Bottom 0.61: v39.37,65.41 v33.66,59.69
STP3  (via drill 0.35)
  Top 0.61: SV1.18 13.97,57.15 v20.32,57.15 | v20.32,60.96 31.11,60.96 34.29,64.14 34.29,66.67 v41.27,73.66 | IC4.7 108.58,62.87 v108.58,67.94
  Bottom 0.61: v20.32,60.96 v20.32,57.15 | v41.27,73.66 40.01,74.93 40.01,78.11 48.9,87 106.68,87 108.58,85.09 v108.58,67.94
STP4  (via drill 0.35)
  Top 0.61: v19.68,15.24 23.5,11.43 v50.16,11.43
  Bottom 0.61: SV1.28 16.51,39.37 16.51,20.95 19.68,17.78 v19.68,15.24 | v50.16,11.43 59.69,11.43 60.33,12.06 60.33,24.13 60.96,24.77 60.96,27.3 60.33,27.94 57.15,27.94 IC5.7
STP5  (via drill 0.35)
  Top 0.61: v17.78,15.24 22.86,10.16 v31.11,10.16 | v48.26,27.94 80.01,27.94 IC6.7
  Bottom 0.61: SV1.33 11.43,34.29 13.97,34.29 15.24,33.02 15.24,20.32 17.78,17.78 v17.78,15.24 | v31.11,10.16 40.01,10.16 48.26,18.41 v48.26,27.94
STP6  (via drill 0.35)
  Top 0.61: SV1.37 11.43,29.21 11.43,22.86 12.7,21.59 29.21,21.59 29.84,20.95 v34.29,20.95 | v43.18,24.13 65.41,24.13 66.67,22.86 v69.85,22.86
  Bottom 0.61: v34.29,20.95 41.27,20.95 41.27,21.59 43.18,23.5 v43.18,24.13 | v69.85,22.86 104.14,22.86 105.41,24.13 IC7.7
TXD  (via drill 0.35)
  Top 0.61: SV1.8 21.59,77.47 v41.27,77.47 | v107.31,81.28 112.39,76.2 121.92,76.2 123.19,74.93 123.19,69.85 J16.4
  Bottom 0.61: v41.27,77.47 47.62,83.82 104.78,83.82 v107.31,81.28

### Text on the board
tNames: ELS | by SMW | HIVE | < | 1 | 2 | 3 | LAE1 | LAE2 | LAE3 | Interface Board | 3V3 | GND | RXD | UART | 4 | 5 | 6 | TXD | 3V3 | GND | SPI 2 | SCLK | PICO | POCI | CE1 | LAE4 | LAE5 | LAE6 | 3V3 | GND | Raspberry PI | SCLK | PICO | POCI | CE0 | SPI 1 | 3V3 | GND | SCL | SDA | I2C | + | - | + | + | - | 12V OUT | 5V OUT | - | 12V IN | + | - | +